# Altium schematic sheet smoker_v3.1a(2).SchDoc
size E
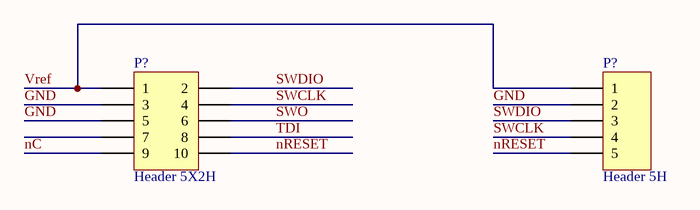
[diagram p0: smoker_v3.1a(2).SchDoc]

## Parts
(Parts that share a designator on the sheet are numbered #1, #2 ... from top to bottom, then left to right.)
P?#1  Header 5X2H  [MHDR2X5]
P?#2  Header 5H  [HDR1X5]

## Nets
GND: P?#1.3 P?#1.5 P?#2.2
nC: P?#1.9
nRESET: P?#1.10 P?#2.5
SWCLK: P?#1.4 P?#2.4
SWDIO: P?#1.2 P?#2.3
SWO: P?#1.6
TDI: P?#1.8
Vref: P?#1.1 P?#2.1

Not connected (* = marked no-connect by the designer): P?#1 7

## Notes on the sheet
- Title
- Size:
- Date:
- File:
- E
- Number:
- Time:
- Revision:
- Sheet
- of

## Library data of the parts
P?#1 = Header 5X2H: Header, 5-Pin, Dual row, Right Angle; LatestRevisionDate: 17-Jul-2002; LatestRevisionNote: Re-released for DXP Platform.; Publisher: Altium Limited
P?#2 = Header 5H: Header, 5-Pin, Right Angle; LatestRevisionDate: 17-Jul-2002; LatestRevisionNote: Re-released for DXP Platform.; Publisher: Altium Limited